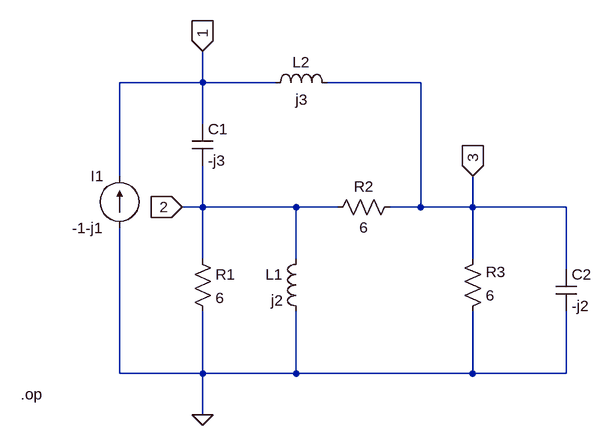
[diagram p0: schematic Thevenin-equivalent-circuit.asc]
Thevenin-equivalent-circuit.asc, the LTspice schematic file:
Version 4
SHEET 1 988 680
WIRE 128 -144 128 -192
WIRE 128 -144 0 -144
WIRE 240 -144 128 -144
WIRE 464 -144 320 -144
WIRE 128 -80 128 -144
WIRE 0 0 0 -144
WIRE 128 48 128 -16
WIRE 128 48 96 48
WIRE 272 48 128 48
WIRE 336 48 272 48
WIRE 464 48 464 -144
WIRE 464 48 416 48
WIRE 544 48 544 0
WIRE 544 48 464 48
WIRE 688 48 544 48
WIRE 128 128 128 48
WIRE 272 128 272 48
WIRE 544 128 544 48
WIRE 688 144 688 48
WIRE 0 304 0 80
WIRE 128 304 128 208
WIRE 128 304 0 304
WIRE 272 304 272 208
WIRE 272 304 128 304
WIRE 544 304 544 208
WIRE 544 304 272 304
WIRE 688 304 688 208
WIRE 688 304 544 304
WIRE 128 368 128 304
FLAG 128 368 0
FLAG 128 -192 1
IOPIN 128 -192 In
FLAG 96 48 2
IOPIN 96 48 In
FLAG 544 0 3
IOPIN 544 0 In
SYMBOL res 112 112 R0
SYMATTR InstName R1
SYMATTR Value 6
SYMBOL res 432 32 R90
WINDOW 0 0 56 VBottom 2
WINDOW 3 32 56 VTop 2
SYMATTR InstName R2
SYMATTR Value 6
SYMBOL res 528 224 M180
WINDOW 0 36 76 Left 2
WINDOW 3 36 40 Left 2
SYMATTR InstName R3
SYMATTR Value 6
SYMBOL ind 288 112 M0
SYMATTR InstName L1
SYMATTR Value j2
SYMBOL ind 224 -128 R270
WINDOW 0 32 56 VTop 2
WINDOW 3 5 56 VBottom 2
SYMATTR InstName L2
SYMATTR Value j3
SYMBOL cap 112 -80 R0
SYMATTR InstName C1
SYMATTR Value -j3
SYMBOL cap 672 144 R0
SYMATTR InstName C2
SYMATTR Value -j2
SYMBOL current 0 80 R180
WINDOW 0 24 80 Left 2
WINDOW 3 24 0 Left 2
WINDOW 39 0 0 Left 2
WINDOW 123 0 0 Left 2
SYMATTR InstName I1
SYMATTR Value -1-j1
TEXT -152 336 Left 2 !.op

The netlist it stands for:
* Thevenin-equivalent-circuit.asc
R1 2 0 6
R2 3 2 6
R3 0 3 6
L1 2 0 j2
L2 1 3 j3
C1 1 2 -j3
C2 3 0 -j2
I1 0 1 -1-j1
.op
.backanno
.end